# Altium schematic sheet Memory.SchDoc: Memory
size 431 x 279 mm; ApprovedBy: Wuji Zhang; CheckedBy: Wuji Zhang; Author: Wuji Zhang; CompanyName: Upenn; DrawnBy: Wuji Zhang; Engineer: Wuji Zhang; Organization: Upenn; Address1: ADDRESS 1; Address2: ADDRESS 2; Address3: ADDRESS 3; Address4: ADDRESS 4; Revision: -; SheetNumber: 6; SheetTotal: 9; ENG_APP_DATE: --/--/--; DSN_APP_DATE: --/--/--; CHK_APP_DATE: --/--/--
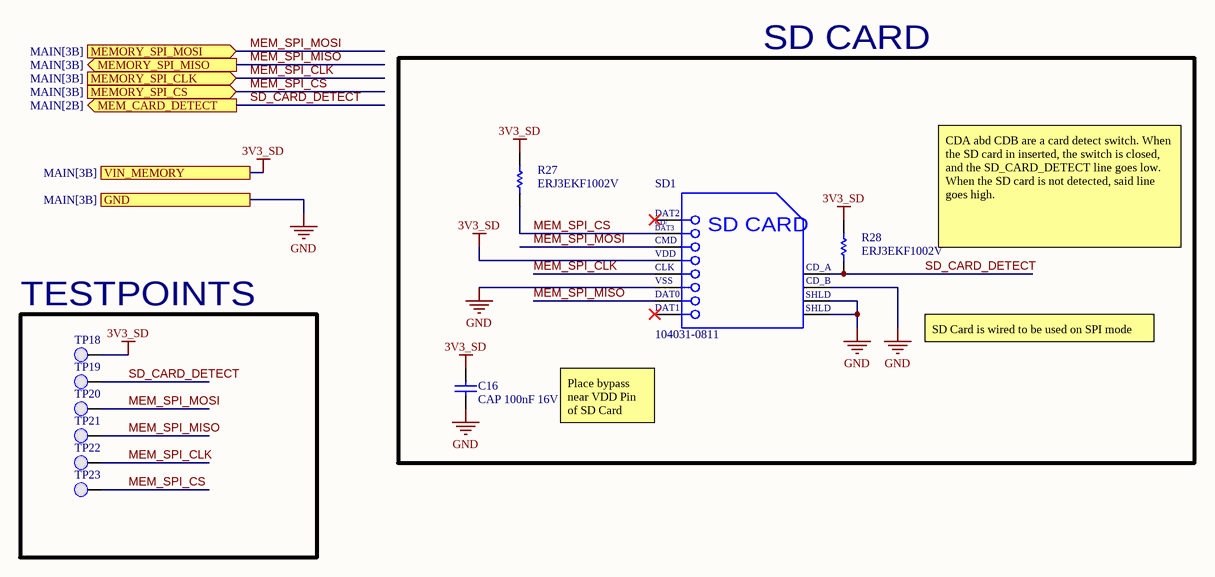
[diagram p0: Memory.SchDoc]

## Parts
C16  CAP 100nF 16V 0603(1608)  [CAPC0603(1608)100_N]
R27  ERJ3EKF1002V  [RESC1609X55X30LL15T15]
R28  ERJ3EKF1002V  [RESC1609X55X30LL15T15]
SD1  104031-0811  [MOLX-104031-0811_V]
TP18  0.1" Pad  [PCBComponent]  (value not drawn)
TP19  0.1" Pad  [PCBComponent]  (value not drawn)
TP20  0.1" Pad  [PCBComponent]  (value not drawn)
TP21  0.1" Pad  [PCBComponent]  (value not drawn)
TP22  0.1" Pad  [PCBComponent]  (value not drawn)
TP23  0.1" Pad  [PCBComponent]  (value not drawn)

## Blocks framed on the sheet
SD CARD: C16 R27 R28 SD1
TESTPOINTS: TP18-TP23

## Ports
GND (see MAIN[3B]), MEM_CARD_DETECT (out, see MAIN[2B]), MEMORY_SPI_CLK (in, see MAIN[3B]), MEMORY_SPI_CS (in, see MAIN[3B]), MEMORY_SPI_MISO (out, see MAIN[3B]), MEMORY_SPI_MOSI (in, see MAIN[3B]), VIN_MEMORY (see MAIN[3B])

## Nets
3V3_SD: C16.2 R27.2 R28.2 SD1.4(VDD) TP18.1(PAD) ; port VIN_MEMORY
GND: C16.1 SD1.6(VSS2) SD1.10(CD_B) SD1.11(SHLD1) SD1.12(SHLD2) ; port GND
MEM_SPI_CLK: SD1.5(CLK) TP22.1(PAD) ; port MEMORY_SPI_CLK
MEM_SPI_CS: R27.1 SD1.2(CMD) TP23.1(PAD) ; port MEMORY_SPI_CS
MEM_SPI_MISO: SD1.7(DAT0) TP21.1(PAD) ; port MEMORY_SPI_MISO
MEM_SPI_MOSI: SD1.3(VSS1) TP20.1(PAD) ; port MEMORY_SPI_MOSI
SD_CARD_DETECT: R28.1 SD1.9(CD_A) TP19.1(PAD) ; port MEM_CARD_DETECT

Not connected (* = marked no-connect by the designer): SD1 1(CD/DAT3)* 8(DAT1)*

## Notes on the sheet
- CDA abd CDB are a card detect switch. When the SD card in inserted, the switch is closed, and the SD_CARD_DETECT line goes low. When the SD card is not detected, said line goes high.
- SD Card is wired to be used on SPI mode
- Place bypass near VDD Pin of SD Card
- DWG. NO.
- REV.
- SHT.
- THIS DOCUMENT AND THE DATA DISCLOSED HEREIN OR HEREWITH IS THE PROPERTY OF ALTIUM LIMITED AND MAY BE FREELY DISTRIBUTED IN WHOLE. NO RIGHTS ARE RESERVED OR EXPRESS OR IMPLIED WARANTEE GIVEN.
- REVISION
- DESCRIPTION
- DATE
- APPROVED
- ENG:
- APPROVALS
- PROJECT
- DSN:
- CHK:
- REFERENCE DOCUMENTS
- PROJECT REVISION:
- TITLE
- DOCUMENT REVISION:
- DESIGN ITEM:
- BOM:
- FAB DWG:
- PCB DWG:
- ASSY DWG:
- SCALE:
- SIZE
- B
- CAGE CODE
- FILE NAME
- DWG NO.
- SHEET
- OF
- REV
- (in symbol CMP-2000-05825-1) DAT2; CD/; DAT3; SD CARD; VSS; SHLD

## Library data of the parts
C16 = CMP-1035-02584-1: CAP 100nF 16V ±10% 0603 (1608 Metric) Thickness 1mm SMD; Tolerance: Â±10%; Case-EIA: 0603; Case-Metric: 1608; Technology: SMT; Max Thickness: 1 mm; Value: 100nF; Rated Voltage: 16 V
R27 R28 = CMP-1012-00623-3: Chip Resistor, 10 KOhm, +/- 1%, 0.1 W, -55 to 155 degC, 0603 (1608 Metric), RoHS, Tape and Reel; Manufacturer: Panasonic; Case\/Package: 0603; Max Power Dissipation: 100mW; Resistance: 10KOhm; Temperature Coefficient: 100ppm\/degreesC; Voltage Rating (DC): 75V; Tolerance: 1%; Case Code (Imperial): 0603; Case Code (Metric): 1608; Composition: ThickFilm; Contact Plating: Tin; Datasheet URL: https://industrial.panasonic.com/cdbs/www-data/pdf/RDA0000/AOA0000C304.pdf; Datasheet Version: 02/2017; Depth: 0.8mm; Height: 0.45mm; Lead Free: LeadFree; Length: 1.6mm; Manufacturer URL: http://www.panasonic.com/; Max Operating Temperature: 155degC; Military Standard: Not; Min Operating Temperature: -55degC; Mount: SurfaceMount; Mounting Technology: SurfaceMount; Number of Pins: 2; Number of Terminations: 2; Package Description: 2-Pin Surface Mount Device, Body 1.6 x 0.85 mm; Package Quantity: 1; Package Reference: 603; Packaging: TapeandReel; Power Rating: 100mW; Radiation Hardening: No; REACH SVHC: NoSVHC; RoHSCompliant: true; Termination: SMD/SMT; Voltage Rating: 75V; Width: 0.031inch
SD1 = CMP-2000-05825-1: Micro SD Card, RA, -25 to 85 degC, 8-Pin SMD, RoHS, Tape and Reel; Voltage Rating: 10VAC/DC; Number of Contacts: 8; Insertion - Extraction Style: Push-Pull; Pitch: 1.1mm; Mating Cycles: 10000; Brand: Molex; Current Rating: 500mA; Manufacturer URL: http://www.molex.com/; Card Type: microSD; Mounting Type: Standard; Height: 1.42mm; Mounting Technology: SurfaceMount; Contact Plating: Gold; Product Category: MemoryCardConnectors; Package Description: 8-Pin Surface Mount Device, Body 11.95 x 11.4 mm, Pitch 1.1 mm; Datasheet URL: http://www.molex.com/pdm_docs/sd/1040310811_sd.pdf; Termination Style: SMD; Length: 11.4mm; Housing Material: LiquidCrystalPolymer(LCP); Orientation: RightAngle; RoHS: True; Contact Material: PhosphorBronze; Datasheet Version: Rev. E, 04/2006; Packaging: Reel; Manufacturer: Molex; Series: 104031; Product: CardConnectors; Number of Rows: 1Row; Package Reference: 104031-0811
TP18-TP23 = 0.1" Pad-A.4